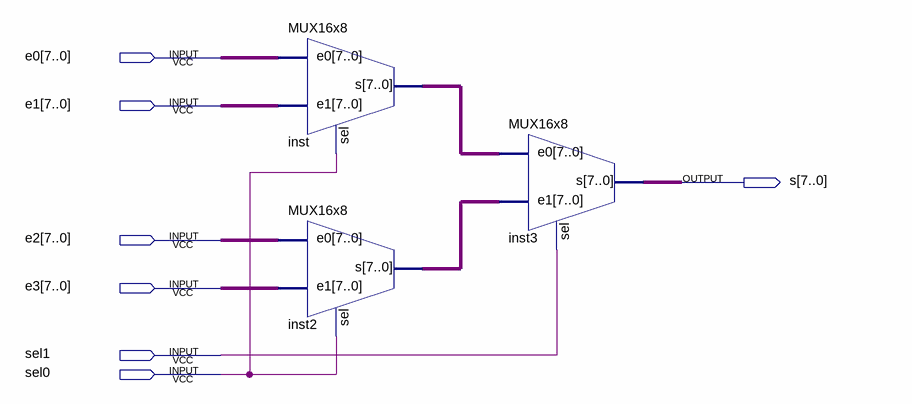
[diagram p0: schematic sheet]
// Quartus schematic MUX32x8.bdf as structural Verilog: 3 symbols, 7 pins
module MUX32x8 (
  input  [7:0] e0,
  input  [7:0] e1,
  input  [7:0] e2,
  input  [7:0] e3,
  input  sel1,
  input  sel0,
  output [7:0] s
);

  wire [7:0] inst2_s, inst_s;

  MUX16x8 inst (.sel(sel0), .e0(e0), .e1(e1), .s(inst_s));
  MUX16x8 inst2 (.sel(sel0), .e0(e2), .e1(e3), .s(inst2_s));
  MUX16x8 inst3 (.sel(sel1), .e0(inst_s), .e1(inst2_s), .s(s));
endmodule
